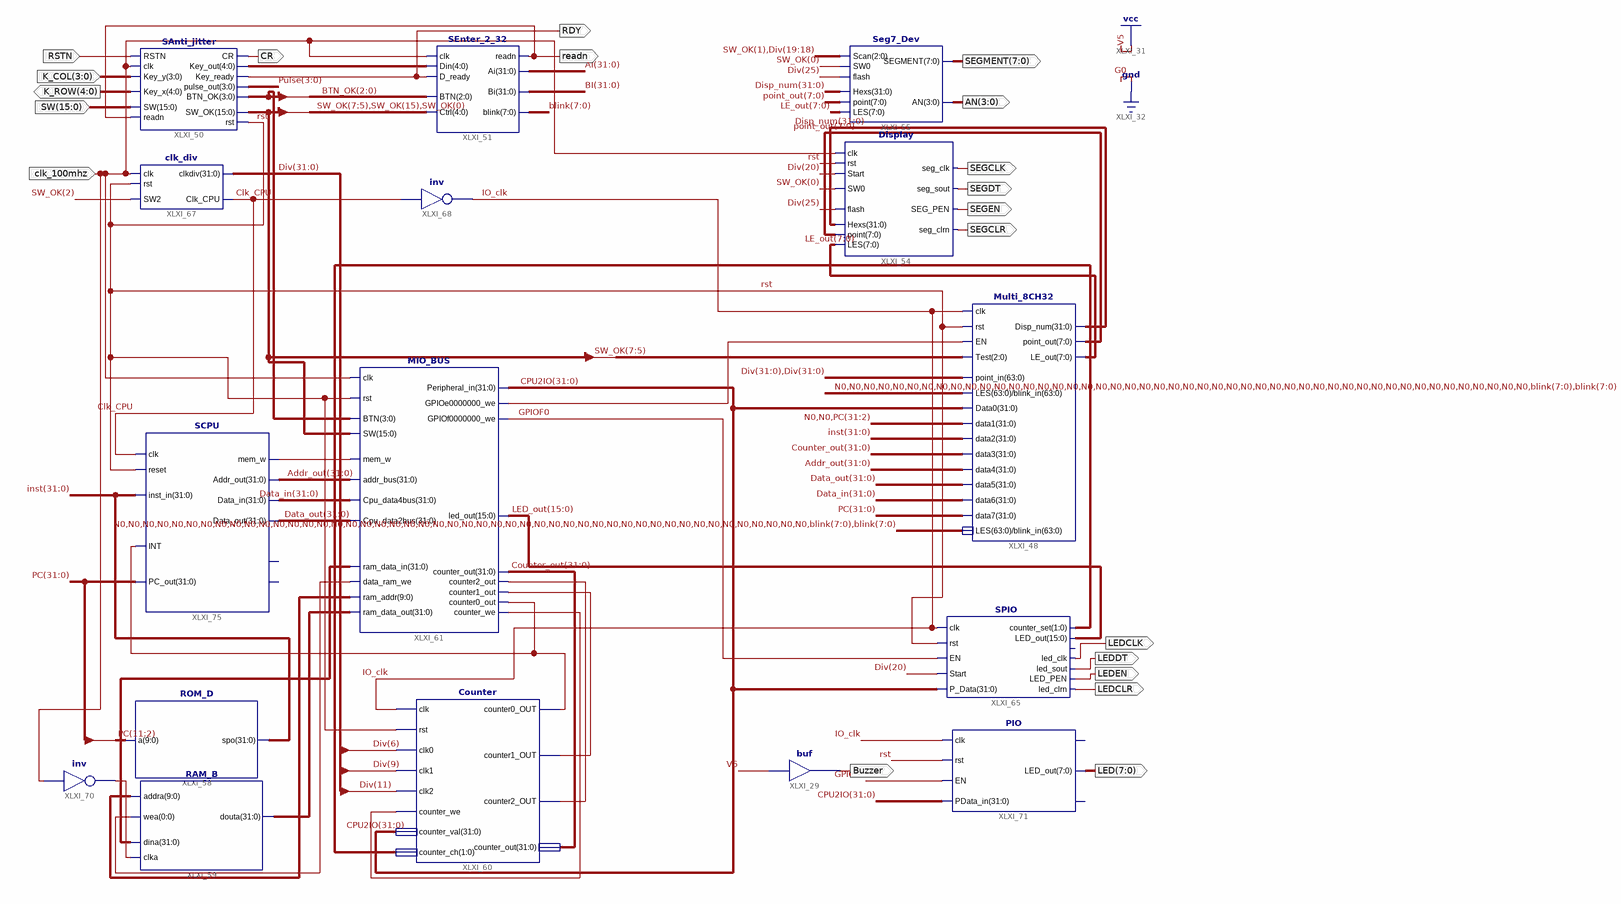
[diagram p0: schematic sheet 1]
// Xilinx ISE schematic framework.sch (kintex7) as structural Verilog: 16 symbols, 20 ports
module framework (
  input  RSTN,
  input  [3:0] K_COL,
  input  [15:0] SW,
  input  clk_100mhz,
  output [4:0] K_ROW,
  output CR,
  output readn,
  output RDY,
  output SEGCLK,
  output SEGDT,
  output SEGEN,
  output SEGCLR,
  output [7:0] SEGMENT,
  output [3:0] AN,
  output Buzzer,
  output LEDCLK,
  output LEDDT,
  output LEDEN,
  output LEDCLR,
  output [7:0] LED
);

  wire Clk_CPU, GPIOF0, IO_clk, N0, rst, XLXN_72, XLXN_81, XLXN_112, XLXN_117, XLXN_121, XLXN_122, XLXN_123;
  wire [0:0] XLXN_108;
  wire [1:0] XLXN_124;
  wire [3:0] BTN_OK, Pulse;
  wire [4:0] XLXN_12;
  wire [7:0] blink, LE_out, point_out;
  wire [9:0] XLXN_107;
  wire [15:0] LED_out, SW_OK;
  wire [31:0] Addr_out, AI, BI, Counter_out, CPU2IO, Data_in, Data_out, Disp_num, Div, inst, PC, XLXN_106,
       XLXN_109;

  buf XLXI_29 (Buzzer, 1'b1);
  Multi_8CH32 XLXI_48 (
    .clk(IO_clk), .rst(rst), .EN(XLXN_117), .Test(SW_OK[7:5]), .point_in({Div, Div}), .Data0(CPU2IO),
    .data1({{2{N0}}, PC[31:2]}), .data2(inst), .data3(Counter_out), .data4(Addr_out), .data5(Data_out),
    .data6(Data_in), .data7(PC), .LES({{48{N0}}, blink, blink}), .point_out(point_out), .LE_out(LE_out),
    .Disp_num(Disp_num), .blink_in({{48{N0}}, blink, blink}));
  SAnti_jitter XLXI_50 (
    .clk(clk_100mhz), .RSTN(RSTN), .readn(readn), .Key_y(K_COL), .SW(SW), .Key_ready(RDY), .CR(CR),
    .rst(rst), .Key_x(K_ROW), .Key_out(XLXN_12), .pulse_out(Pulse), .BTN_OK(BTN_OK), .SW_OK(SW_OK));
  SEnter_2_32 XLXI_51 (
    .clk(clk_100mhz), .D_ready(RDY), .BTN(BTN_OK[2:0]), .Ctrl({SW_OK[7:5], SW_OK[15], SW_OK[0]}),
    .Din(XLXN_12), .readn(readn), .Ai(AI), .Bi(BI), .blink(blink));
  Display XLXI_54 (
    .clk(clk_100mhz), .rst(rst), .Start(Div[20]), .flash(Div[25]), .Hexs(Disp_num), .point(point_out),
    .LES(LE_out), .SW0(SW_OK[0]), .seg_clk(SEGCLK), .seg_sout(SEGDT), .SEG_PEN(SEGEN), .seg_clrn(SEGCLR));
  Seg7_Dev XLXI_55 (
    .flash(Div[25]), .Scan({SW_OK[1], Div[19:18]}), .Hexs(Disp_num), .point(point_out), .LES(LE_out),
    .SW0(SW_OK[0]), .AN(AN), .SEGMENT(SEGMENT));
  ROM_D XLXI_58 (.a(PC[11:2]), .spo(inst));
  RAM_B XLXI_59 (.addra(XLXN_107), .clka(XLXN_112), .wea(XLXN_108[0]), .dina(XLXN_109), .douta(XLXN_106));
  Counter XLXI_60 (
    .clk(IO_clk), .rst(rst), .clk0(Div[6]), .clk1(Div[9]), .clk2(Div[11]), .counter_we(XLXN_123),
    .counter_val(CPU2IO), .counter_ch(XLXN_124), .counter0_OUT(XLXN_72), .counter1_OUT(XLXN_122),
    .counter2_OUT(XLXN_121), .counter_out(Counter_out));
  MIO_BUS XLXI_61 (
    .rst(rst), .clk(clk_100mhz), .mem_w(XLXN_81), .addr_bus(Addr_out), .Cpu_data4bus(Data_in),
    .Cpu_data2bus(Data_out), .ram_data_out(XLXN_106), .ram_addr(XLXN_107), .data_ram_we(XLXN_108[0]),
    .ram_data_in(XLXN_109), .counter_out(Counter_out), .counter2_out(XLXN_121), .counter1_out(XLXN_122),
    .counter0_out(XLXN_72), .counter_we(XLXN_123), .BTN(BTN_OK), .SW(SW_OK), .led_out(LED_out),
    .Peripheral_in(CPU2IO), .GPIOe0000000_we(XLXN_117), .GPIOf0000000_we(GPIOF0));
  SPIO XLXI_65 (
    .clk(IO_clk), .P_Data(CPU2IO), .rst(rst), .EN(GPIOF0), .Start(Div[20]), .led_clk(LEDCLK),
    .LED_out(LED_out), .counter_set(XLXN_124), .led_clrn(LEDCLR), .LED_PEN(LEDEN), .led_sout(LEDDT));  // open: GPIOf0
  clk_div XLXI_67 (.rst(rst), .clk(clk_100mhz), .SW2(SW_OK[2]), .clkdiv(Div), .Clk_CPU(Clk_CPU));
  not XLXI_68 (IO_clk, Clk_CPU);
  not XLXI_70 (XLXN_112, clk_100mhz);
  PIO XLXI_71 (.clk(IO_clk), .rst(rst), .EN(GPIOF0), .PData_in(CPU2IO), .LED_out(LED));  // open: GPIOf0, counter_set
  SCPU XLXI_75 (
    .clk(Clk_CPU), .reset(rst), .inst_in(inst), .INT(XLXN_72), .Addr_out(Addr_out), .mem_w(XLXN_81),
    .Data_out(Data_out), .Data_in(Data_in), .PC_out(PC));  // open: CPU_MIO, MIO_ready
endmodule
